# Altium schematic sheet USB_to_UART.SchDoc
size A
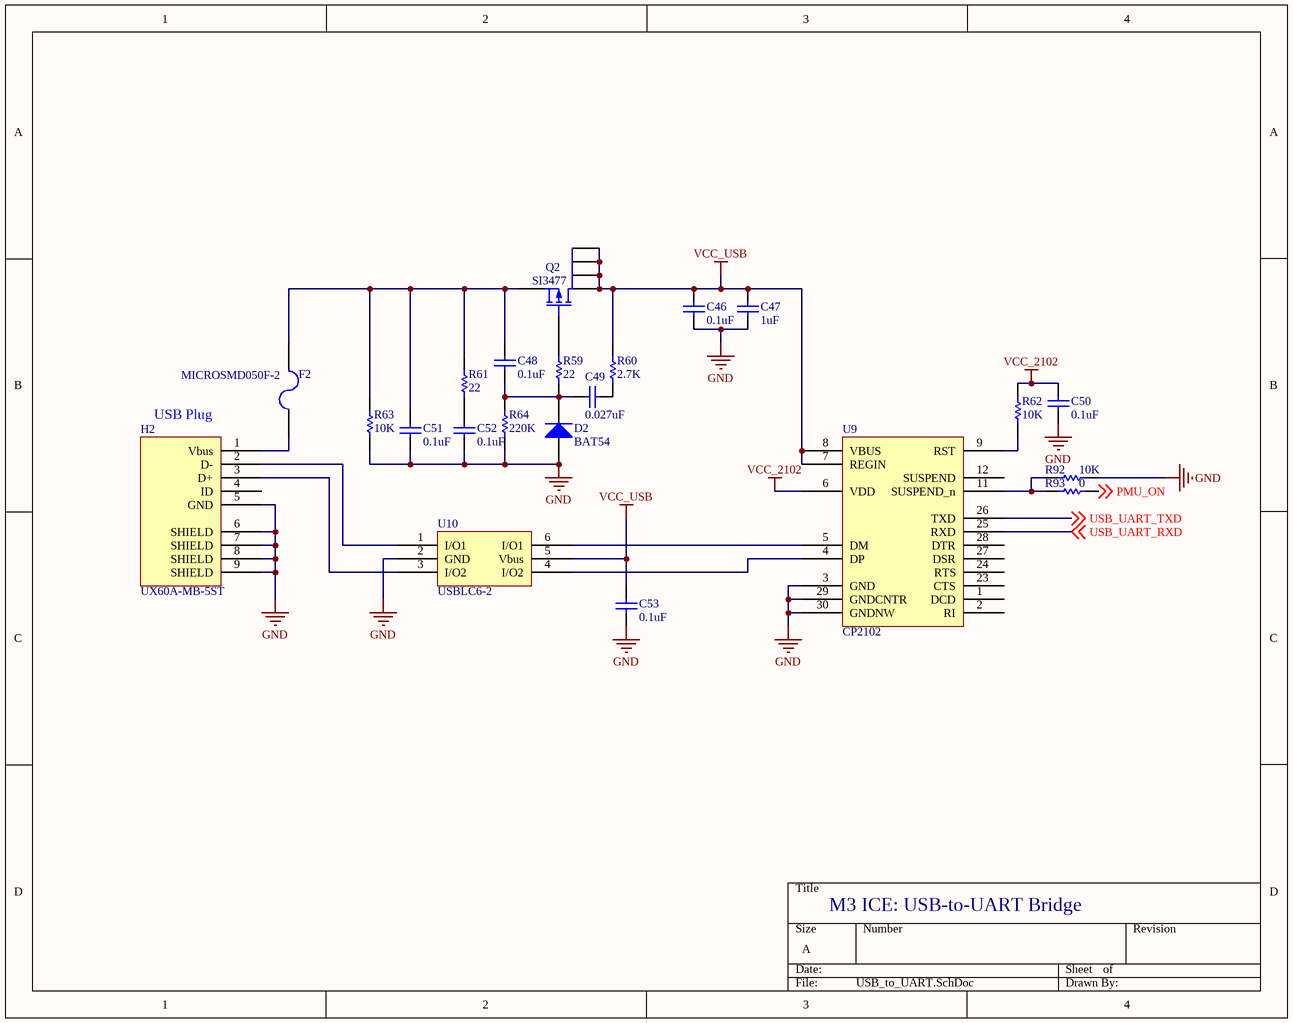
[diagram p0: USB_to_UART.SchDoc]

## Parts
C46  value 0.1uF  [1608[0603]]  (hidden comment: Cap Semi)
C47  value 1uF  [1608[0603]]  (hidden comment: Cap Semi)
C48  value 0.1uF  [1608[0603]]  (hidden comment: Cap Semi)
C49  value 0.027uF  [1608[0603]]  (hidden comment: Cap Semi)
C50  value 0.1uF  [1608[0603]]  (hidden comment: Cap Semi)
C51  value 0.1uF  [1608[0603]]  (hidden comment: Cap Semi)
C52  value 0.1uF  [1608[0603]]  (hidden comment: Cap Semi)
C53  value 0.1uF  [1608[0603]]  (hidden comment: Cap Semi)
D2  BAT54  [SOT-23_N]
F2  MICROSMD050F-2  [1210]
H2  UX60A-MB-5ST  [USB Mini-B]
Q2  SI3477  [TSOP-6]
R59  value 22  [0603]  (hidden comment: Res Chip)
R60  value 2.7K  [0603]  (hidden comment: Res Chip)
R61  value 22  [0603]  (hidden comment: Res Chip)
R62  value 10K  [0603]  (hidden comment: Res Chip)
R63  value 10K  [0603]  (hidden comment: Res Chip)
R64  value 220K  [0603]  (hidden comment: Res Chip)
R92  value 10K  [0402]  (hidden comment: Res Chip)
R93  value 0  [0402]  (hidden comment: Res Chip)
U9  CP2102  [QFN-28]
U10  USBLC6-2  [SOT23-6_L]

## Nets
GND: C46.1 C47.1 C50.1 C51.1 C52.1 C53.1 D2.1(A) H2.5(GND) H2.6(SHIELD) H2.7(SHIELD) H2.8(SHIELD) H2.9(SHIELD) R63.1 R64.1 R92.2 U9.3(GND) U9.29(GNDCNTR) U9.30(GNDNW) U10.2(GND)
VCC_2102: C50.2 R62.2 U9.6(VDD)
VCC_USB: C46.2 C47.2 C53.2 Q2.1(D) Q2.2(D) Q2.5(D) Q2.6(D) R60.2 U9.7(REGIN) U9.8(VBUS) U10.5(Vbus)
PMU_ON: R93.2 ; off-sheet PMU_ON
USB_UART_RXD: U9.25(RXD) ; off-sheet USB_UART_RXD
USB_UART_TXD: U9.26(TXD) ; off-sheet USB_UART_TXD
NetC48_1: C48.1 C49.2 D2.3(K) R59.1 R64.2
NetC48_2: C48.2 C51.2 F2.2 Q2.4(S) R61.2 R63.2
NetC49_1: C49.1 R60.1
NetC52_2: C52.2 R61.1
NetF2_1: F2.1 H2.1(Vbus)
NetH2_2: H2.2(D-) U10.1(I/O1)
NetH2_3: H2.3(D+) U10.3(I/O2)
NetQ2_3: Q2.3(G) R59.2
NetR62_1: R62.1 U9.9(RST)
NetR92_1: R92.1 R93.1 U9.11(SUSPEND_n)
NetU9_4: U9.4(DP) U10.4(I/O2)
NetU9_5: U9.5(DM) U10.6(I/O1)

Not connected (* = marked no-connect by the designer): H2 4(ID); U9 1(DCD) 2(RI) 12(SUSPEND) 23(CTS) 24(RTS) 27(DSR) 28(DTR)

## Notes on the sheet
- (near H2) USB Plug
- M3 ICE: USB-to-UART Bridge

## Library data of the parts
C46 C48 C50-C53 = Cap Semi: Capacitor (Semiconductor SIM Model); DistPartNo: 445-1317-1-ND; ManPartNo: C1608X7R1C104K; Published: 8-Jun-2000; LatestRevisionDate: 29-May-2009; LatestRevisionNote: IPC-7351 Footprint Added.; PackageReference: C1206; Publisher: Altium Limited; PackageDescription: Chip Capacitor
C47 = Cap Semi: Capacitor (Semiconductor SIM Model); DistPartNo: 445-1327-1-ND; ManPartNo: C1608Y5V1C105Z; Published: 8-Jun-2000; LatestRevisionDate: 29-May-2009; LatestRevisionNote: IPC-7351 Footprint Added.; PackageReference: C1206; Publisher: Altium Limited; PackageDescription: Chip Capacitor
C49 = Cap Semi: Capacitor (Semiconductor SIM Model); DistPartNo: 478-1232-1-ND; ManPartNo: 06035C273KAT2A; Published: 8-Jun-2000; LatestRevisionDate: 29-May-2009; LatestRevisionNote: IPC-7351 Footprint Added.; PackageReference: C1206; Publisher: Altium Limited; PackageDescription: Chip Capacitor
D2 = Diode BAT18: Low-Loss RF Switching Diode; DistPartNo: BAT54-FDICT-ND; ManPartNo: BAT54-7-F; Note: Pin 2 is not connected and not drawn.; Published: 21-Mar-2003; LatestRevisionDate: 29-May-2009; LatestRevisionNote: IPC-7351 Footprint Added.; DatasheetVersion: Oct-1999; PackageVersion: Sep-2001; PackageReference: SOT-23; Publisher: Altium Limited; PackageDescription: 3-Pin SOT-23 Package 0.95 mm Pitch, 2.5 mm Lead Span; ComponentLink1Description: Manufacturer Link; ComponentLink1URL: http://www.infineon.com/
F2 = Fuse MICROSMD050F-2: POLYSWITCH 0.50A RESET FUSE SMD; DistPartNo: MICROSMD050FCT-ND; ManPartNo: MICROSMD050F-2
H2 = UX60-MB-5ST: USB mini-B; DistPartNo: H2961CT-ND; ManPartNo: UX60A-MB-5ST
Q2 = SI3477: P-Channel MOSFET; DistPartNo: SI3477DV-T1-GE3CT-ND; ManPartNo: SI3477DV-T1-GE3
R59 R61 = Res Chip: Semiconductor Resistor; DistPartNo: P22GCT-ND; ManPartNo: ERJ-3GEYJ220V; Published: 8-Jun-2000; LatestRevisionDate: 17-Jul-2002; LatestRevisionNote: Re-released for DXP Platform.; PackageReference: AXIAL-0.5; Publisher: Altium Limited; PackageDescription: Axial Device, Thru-Hole; 2 Leads; 0.5 in Pin Spacing
R60 = Res Chip: Semiconductor Resistor; DistPartNo: P2.7KGCT-ND; ManPartNo: ERJ-3GEYJ272V; Published: 8-Jun-2000; LatestRevisionDate: 17-Jul-2002; LatestRevisionNote: Re-released for DXP Platform.; PackageReference: AXIAL-0.5; Publisher: Altium Limited; PackageDescription: Axial Device, Thru-Hole; 2 Leads; 0.5 in Pin Spacing
R62 R63 = Res Chip: Semiconductor Resistor; DistPartNo: P10KGCT-ND; ManPartNo: ERJ-3GEYJ103V; Published: 8-Jun-2000; LatestRevisionDate: 17-Jul-2002; LatestRevisionNote: Re-released for DXP Platform.; PackageReference: AXIAL-0.5; Publisher: Altium Limited; PackageDescription: Axial Device, Thru-Hole; 2 Leads; 0.5 in Pin Spacing
R64 = Res Chip: Semiconductor Resistor; DistPartNo: P220KGCT-ND; ManPartNo: ERJ-3GEYJ224V; Published: 8-Jun-2000; LatestRevisionDate: 17-Jul-2002; LatestRevisionNote: Re-released for DXP Platform.; PackageReference: AXIAL-0.5; Publisher: Altium Limited; PackageDescription: Axial Device, Thru-Hole; 2 Leads; 0.5 in Pin Spacing
R92 = Res Chip: Semiconductor Resistor; DistPartNo: P10.0KLCT-ND; ManPartNo: ERJ-2RKF1002X; Published: 8-Jun-2000; LatestRevisionDate: 17-Jul-2002; LatestRevisionNote: Re-released for DXP Platform.; PackageReference: AXIAL-0.5; Publisher: Altium Limited; PackageDescription: Axial Device, Thru-Hole; 2 Leads; 0.5 in Pin Spacing
R93 = Res Chip: Semiconductor Resistor; DistPartNo: P0.0JCT-ND; ManPartNo: ERJ-2GE0R00X; Published: 8-Jun-2000; LatestRevisionDate: 17-Jul-2002; LatestRevisionNote: Re-released for DXP Platform.; PackageReference: AXIAL-0.5; Publisher: Altium Limited; PackageDescription: Axial Device, Thru-Hole; 2 Leads; 0.5 in Pin Spacing
U9 = CP2102: DistPartNo: 336-1160-5-ND; ManPartNo: CP2102-GM
U10 = USBLC6-2: USB ESD Protection; DistPartNo: 497-11882-1-ND; ManPartNo: USBLC6-2SC6Y